# Altium schematic sheet Project_Information.SchDoc: =project_title
size Tabloid; CompanyName: Luxonis Holding; Organization: Luxonis Holding; Address1: 1925 Harmony Park Drive; Address2: Westminster, CO; Address3: 80234; Address4: United States; SheetNumber: 1; SheetTotal: 3
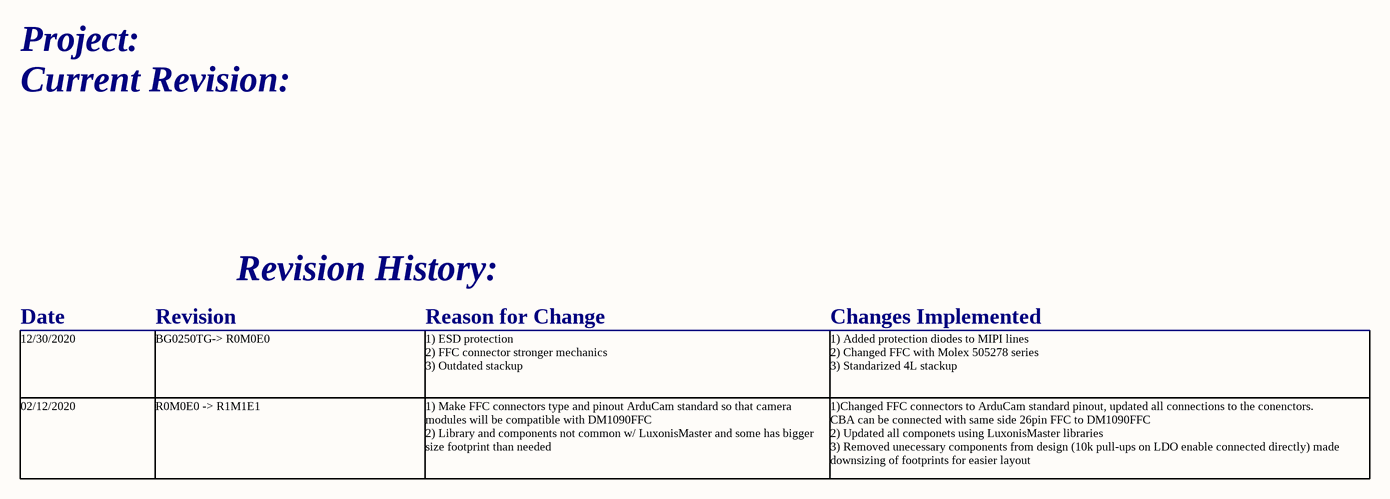
[diagram p0: Project_Information.SchDoc]

## Notes on the sheet
- Project:
- Current Revision:
- Revision History:
- Date
- Revision
- Reason for Change
- Changes Implemented
- 12/30/2020
- BG0250TG-> R0M0E0
- 1) ESD protection
  2) FFC connector stronger mechanics
  3) Outdated stackup
- 1) Added protection diodes to MIPI lines
  2) Changed FFC with Molex 505278 series
  3) Standarized 4L stackup
- 02/12/2020
- R0M0E0 -> R1M1E1
- 1) Make FFC connectors type and pinout ArduCam standard so that camera modules will be compatible with DM1090FFC
  2) Library and components not common w/ LuxonisMaster and some has bigger size footprint than needed
- 1)Changed FFC connectors to ArduCam standard pinout, updated all connections to the conenctors.
  CBA can be connected with same side 26pin FFC to DM1090FFC
  2) Updated all componets using LuxonisMaster libraries
  3) Removed unecessary components from design (10k pull-ups on LDO enable connected directly) made downsizing of footprints for easier layout
- Title
- Size:
- Date:
- Tabloid
- Number:
- Time:
- Revision:
- Sheet
- of
- Drawn by: